# EAGLE design LB_BIT_o2_LONGLED-v03(rev2) (EAGLE 6.6.0)
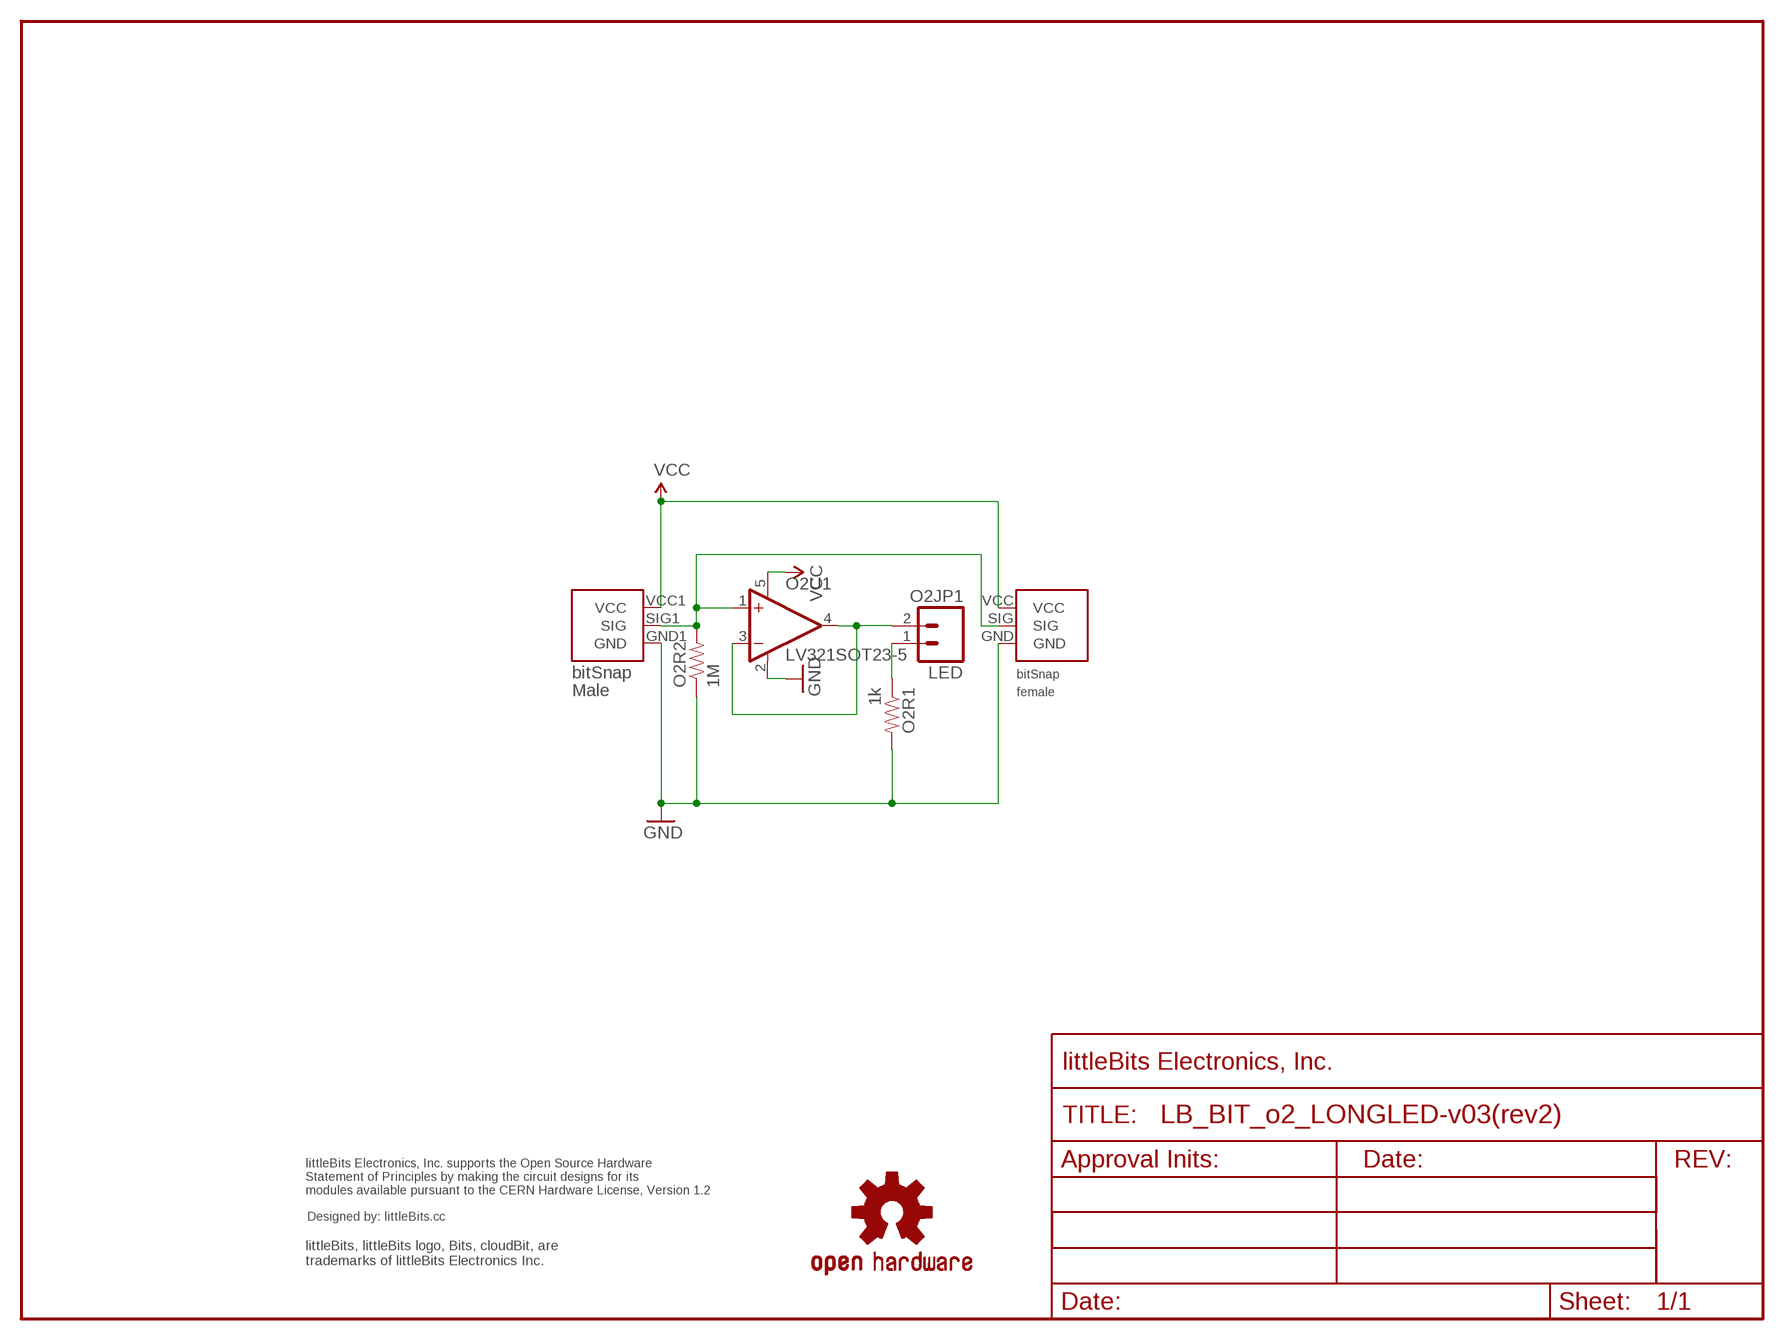
[diagram p0: schematic, sheet 1]

## Parts
O2BSF  BITSNAP_V03_FEMALE  [BITSNAP_V03_FEMALE]
O2BSM  BITSNAP_V03_MALE  [BITSNAP_V03_MALE]
O2JP1  LED  M02-JST-2MM-SMT  [S2B-PH]
O2R1  1k  RESISTOR0603-RES  [0603-RES]
O2R2  1M  RESISTOR0603-RES  [0603-RES]
O2U1  LV321SOT23-5  [SOT23-5]
U$1  OSHWCREDIT  [OSHWCREDIT]
U$2  FRAME-LETTER-OHWOHW  [FABDWG01-OHW]
U$14  OSHW-LOGOL  [OSHW-LOGO-L]

## Nets
GND: O2BSF.GND O2BSM.GND1(GND) O2R1.2 O2R2.1 O2U1.2(V-)
N$1: O2JP1.1 O2R1.1
N$6: O2BSF.SIG O2BSM.SIG1(SIG) O2R2.2 O2U1.1(+IN)
N$8: O2JP1.2 O2U1.3(-IN) O2U1.4(OUT)
VCC: O2BSF.VCC O2BSM.VCC1(VCC) O2U1.5(V+)

## Library data of the parts
O2BSF = bitSnap:BITSNAP_V03_FEMALE
O2BSM = bitSnap:BITSNAP_V03_MALE
O2JP1 = SparkFun:M02: Header 2 Standard 2-pin 0.1" header. Use with straight break away headers (SKU : PRT-00116), right angle break away headers (PRT-00553), swiss pins (PRT-00743), machine pins (PRT-00117), and female headers (PRT-00115). Molex polarized connector foot print use with SKU : PRT-08233 with associated crimp pins and housings.
O2R1 O2R2 = SparkFun:RESISTOR: Resistor Basic schematic elements and footprints for 0603, 1206, and PTH 1/10th watt (small) resistors.
O2U1 = LITTLEBITS:LV321
U$1 = LITTLEBITS:OSHWCREDIT
U$2 = LITTLEBITS:FRAME-LETTER-OHW
U$14 = SparkFun_NEW:OSHW-LOGO: Open Source Hardware Logo This logo indicates the piece of hardware it is found on incorporates a OSHW license and/or adheres to the definition of open source hardware found here: http://freedomdefined.org/OSHW

## Board
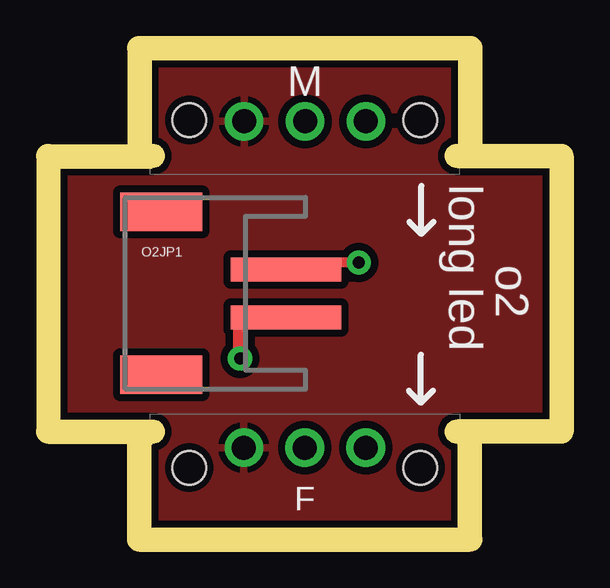
[diagram p1: board, top side]
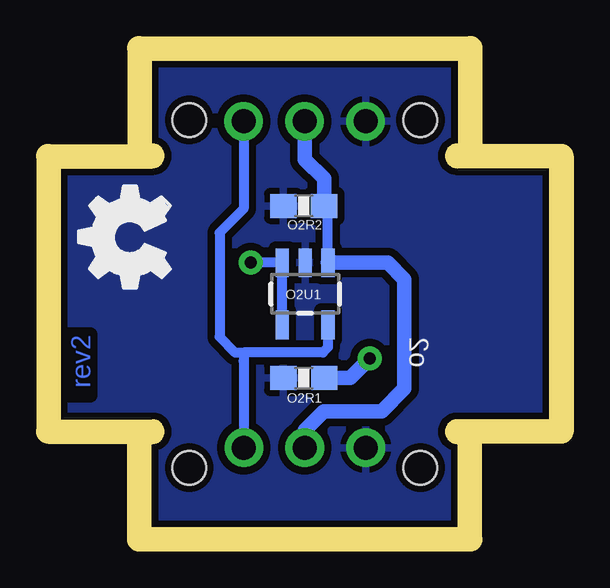
[diagram p2: board, bottom side, seen from below]

Size 20.4 x 19.5 mm. Coordinates in mm from the lower left corner, seen from the top.
Outline: 0,4.5 0,15
Outline: 20.4,15 20.4,4.5
Copper layers (1*16): Top 0.035mm / dielectric 1.5mm / Bottom 0.035mm
Design rules "default": minimum track width 8mil, minimum drill 20mil, track to track 8mil, track to pad 8mil, pad to pad 8mil, via to via 8mil, smd to smd 8mil, copper to edge 10mil, drill to drill 8mil, minimum pad ring 12mil, minimum via ring 10mil, stop-mask expansion 4mil, vias tented up to drill 25mil, thermal gap 10mil
Milling: 2 lines

### Footprints (pad centres in the part's own frame; a part is rotated, then mirrored left to right if it is on the bottom)
BITSNAP_V03_FEMALE = drill 1: GND 3.91,3.33; SIG 6.45,3.33; VCC 8.99,3.33 | hole 1.4: 1.63,2.5; 11.27,2.5
BITSNAP_V03_MALE = drill 1: GND1 8.98,2.56; SIG1 6.44,2.56; VCC1 3.9,2.56 | hole 1.4: 11.27,2.5; 1.63,2.5
S2B-PH = smd 1 x 4.6: 1 -1,-3.7; 2 1,-3.7 | smd 1.6 x 3.4: NC1 -3.4,1.5; NC2 3.4,1.5
0603-RES = smd 1.1 x 1: 1 -0.85,0; 2 0.85,0
SOT23-5 = smd 0.55 x 1.2: 1 -0.95,-1.3; 2 0,-1.3; 3 0.95,-1.3; 4 0.95,1.3; 5 -0.95,1.3

### Placement (x,y rotation side)
O2BSF  3.75,0 0 top
O2BSM  16.65,19.5 180 top
O2JP1  5.72,9.77 90 top
O2R1  10.24,6.24 180 bottom
O2R2  10.24,13.41 0 bottom
O2U1  10.19,9.74 180 bottom
U$1  -34.65,-29.8 0 top  (outside the outline)
U$2  0,0 0 top
U$7  [OSHW_FILLX150_NOTEXT]  15.81,9.16 0 top
U$14  -30.34,-15.28 0 top  (outside the outline)

### Tracks (layer width: path | path; a pad name or v marks a point on that pad's centre or on a via)
GND
  pour Top (isolate 0.305): 0.17,19.33 20.2,19.33 20.2,0.17 0.17,0.22
  pour Bottom (isolate 0.305): 0.17,19.33 20.2,19.33 20.2,0.17 0.17,0.22
N$1  (via drill 0.5)
  Top 0.61: v7.5,7.05 7.5,8.75 O2JP1.1
  Bottom 0.61: O2R1.1 8.31,6.24 v7.5,7.05
N$6
  Bottom 0.406: O2U1.1 9.24,13.26 O2R2.2
  Bottom 0.61: O2R2.2 9.39,14.54 10.2,15.35 O2BSM.SIG1 | O2BSF.SIG 10.2,4.05 9.4,4.85 7,4.85 6.05,5.8 6.05,10.35 6.75,11.05 O2U1.1
N$8  (via drill 0.5)
  Top 0.406: v12.45,11.05 8.55,11.05 8.3,10.8 8.15,10.95 7.45,10.95 O2JP1.2
  Bottom 0.406: O2U1.4 O2U1.3 v12.44,11.04 v12.45,11.05
VCC
  Bottom 0.406: O2U1.5 9.24,7.51 9.45,7.3 12.75,7.3 12.74,7.29 | O2BSF.VCC 12.75,6.94 12.74,7.29 | O2BSM.VCC1 12.75,13.3 13.75,12.3 13.75,7.95 13.09,7.29 12.74,7.29

### Text on the board
Bottom: rev2
tPlace: long led | o2
Milling: 1mm DIA. ROUTER PATH
_bsilk: o2